# EAGLE design MS5803-02BAv2 (EAGLE 9.5.1)
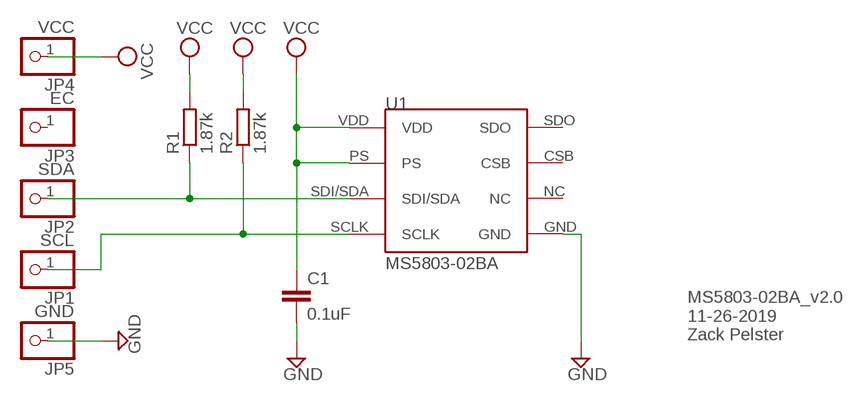
[diagram p0: schematic, sheet 1]

## Parts
C1  0.1uF  C-EUC0805  [C0805]
JP1  SCL  PINHD-1X1  [1X01]
JP2  SDA  PINHD-1X1  [1X01]
JP3  EC  PINHD-1X1  [1X01]
JP4  VCC  PINHD-1X1  [1X01]
JP5  GND  PINHD-1X1  [1X01]
R1  1.87k  R-EU_R0805  [R0805]
R2  1.87k  R-EU_R0805  [R0805]
U1  MS5803-02BA  [MS5803-02BA]

## Nets
GND: C1.2 JP5.1 U1.GND
N$1: JP2.1 R1.1 U1.SDI/SDA
N$2: JP1.1 R2.1 U1.SCLK
VCC: C1.1 JP4.1 R1.2 R2.2 U1.PS U1.VDD
Unconnected: JP3.1 U1.CSB U1.NC U1.SDO

## Notes on the sheet
- MS5803-02BA_v2.0
  11-26-2019
  Zack Pelster

## Library data of the parts
C1 = rcl:C-EU: CAPACITOR, European symbol; SPICEPREFIX: C
JP1-JP5 = pinhead_simple:PINHD-1X1: PIN HEADER
R1 R2 = rcl:R-EU_: RESISTOR, European symbol; SPICEPREFIX: R
U1 = PNNL_Probe:MS5803-02BA

## Board
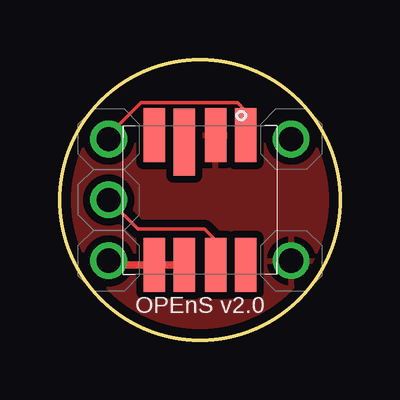
[diagram p1: board, top side]
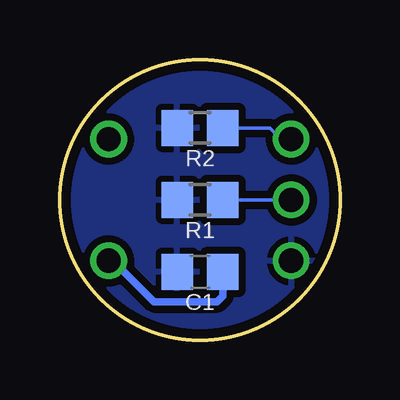
[diagram p2: board, bottom side, seen from below]

Size 11.68 x 11.68 mm. Coordinates in mm from the lower left corner, seen from the top.
Outline: circle at 5.84,5.84 radius 5.84
Copper layers (1*16): Top 0.035559375mm / dielectric 1.6mm / Bottom 0.035559375mm
Design rules "oshpark-2layer": minimum track width 6mil, minimum drill 10mil, track to track 6mil, track to pad 6mil, pad to pad 6mil, via to via 6mil, smd to smd 6mil, copper to edge 15mil, drill to drill 6mil, minimum pad ring 5mil, minimum via ring 5mil, stop-mask expansion 2.5mil, vias tented up to drill 0mil, thermal gap 10mil

### Footprints (pad centres in the part's own frame; a part is rotated, then mirrored left to right if it is on the bottom)
C0805 = smd 1.3 x 1.5: 1 -0.95,0; 2 0.95,0
1X01 = drill 1.016: 1 0,0
R0805 = smd 1.3 x 1.5: 1 -0.95,0; 2 0.95,0
MS5803-02BA = smd 2.8 x 0.9: CSB 2.42,0.65 | smd 2.25 x 0.9: GND 2.7,-0.65; NC 2.7,1.9; PS -2.7,0.65; SCLK 2.7,-1.9; SDI/SDA -2.7,-0.65; SDO -2.7,-1.9; VDD -2.7,1.9

### Placement (x,y rotation side)
C1  5.84,2.84 0 bottom
JP1  2.03,8.38 0 top
JP2  2.03,5.84 0 top
JP3  9.65,8.38 0 top
JP4  2.03,3.3 0 top
JP5  9.65,3.3 0 top
R1  5.84,5.84 180 bottom
R2  5.84,8.84 180 bottom
U1  5.84,5.84 90 top

### Tracks (layer width: path | path; a pad name or v marks a point on that pad's centre or on a via)
GND
  Bottom 0.305: C1.2 4.88,1.83 5.12,1.59 7.75,1.59 9.46,3.3 JP5.1
  pour Top (isolate 0.305): 13.7,12.43 13.7,1.89 9.73,-2.08 2.35,-2.08 -1.72,2 -1.72,8.9 1.81,12.43
N$1
  Top 0.152: U1.SDI/SDA 6.49,4.17 6.04,4.62 3.25,4.62 JP2.1
  Bottom 0.152: JP2.1 R1.1
N$2
  Top 0.152: U1.SCLK 7.74,9.55 7.4,9.9 3.38,9.9 2.03,8.54 JP1.1
  Bottom 0.152: R2.1 2.92,8.84 2.46,8.38 JP1.1
VCC
  Top 0.305: U1.PS U1.VDD 2.19,3.14 JP4.1
  pour Bottom (isolate 0.305): -1.73,1.98 2.35,-2.1 9.77,-2.1 13.6,1.73 13.6,10.42 11.92,12.09 -1.36,12.09 -1.7,12.43

### Text on the board
tPlace: OPEnS v2.0